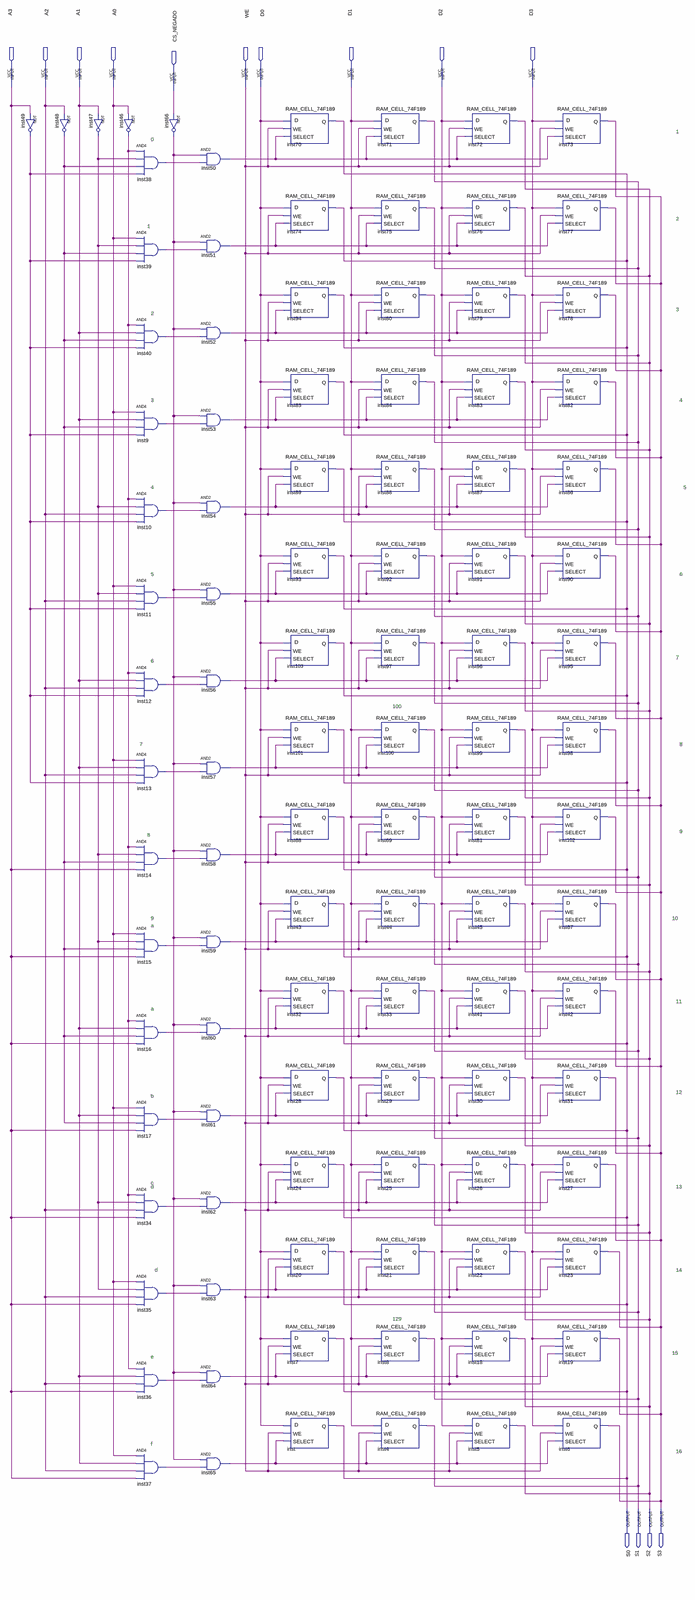
[diagram p0: schematic sheet, whole]
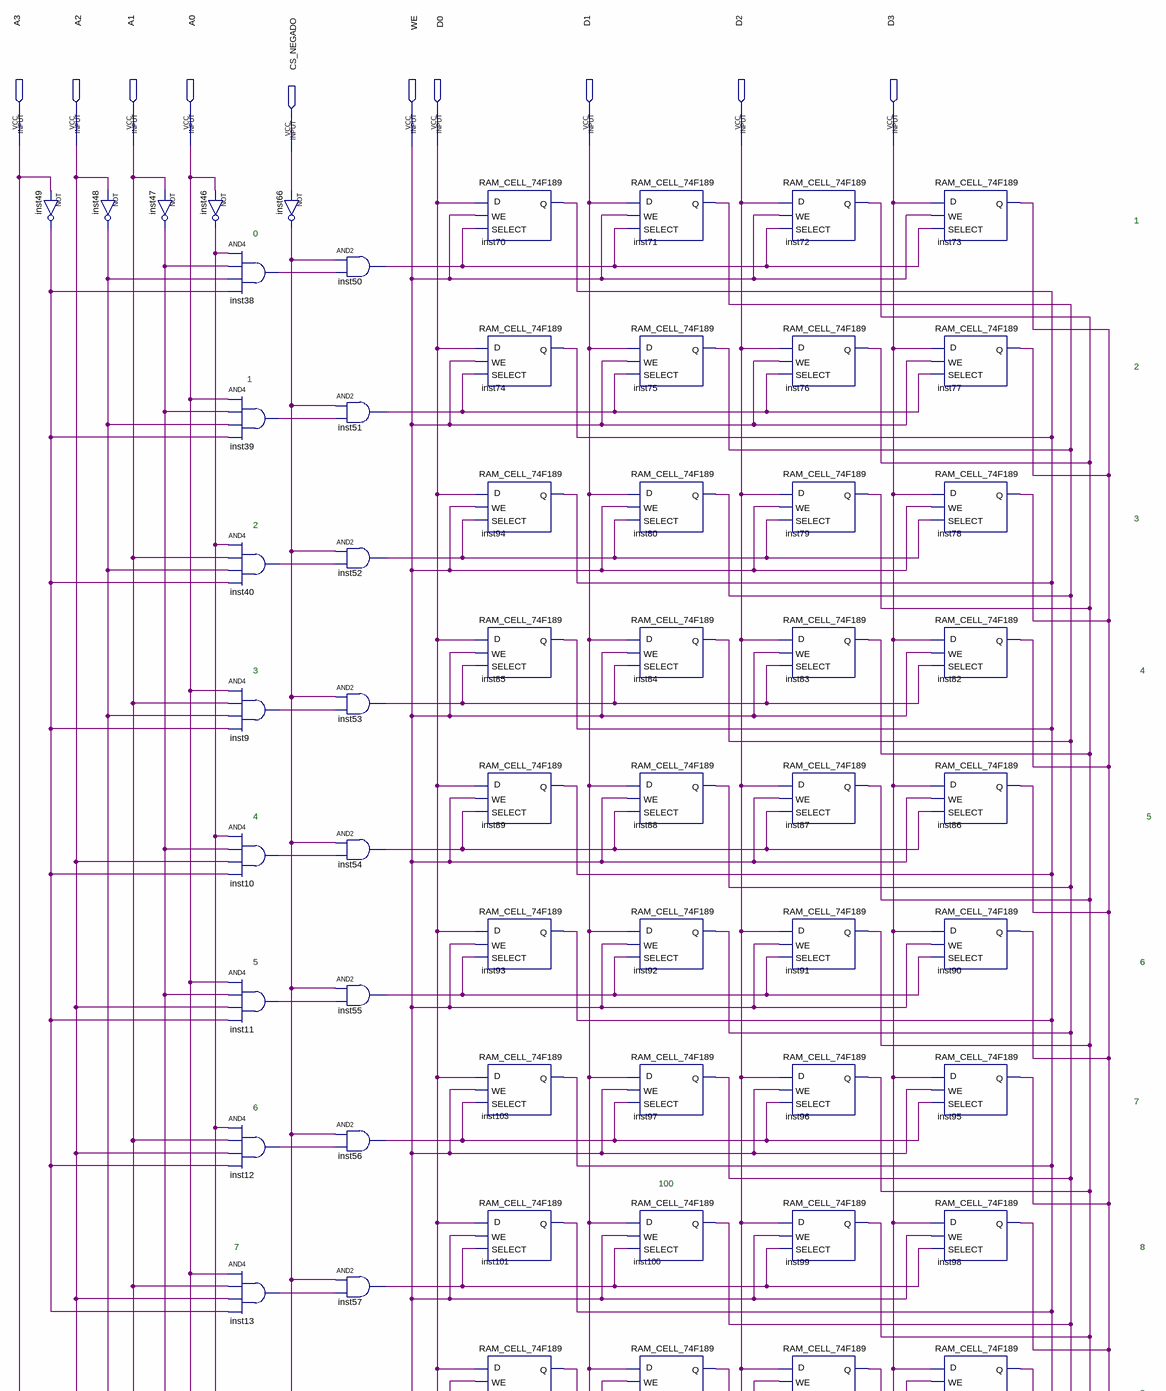
[diagram p1: schematic sheet, upper part]
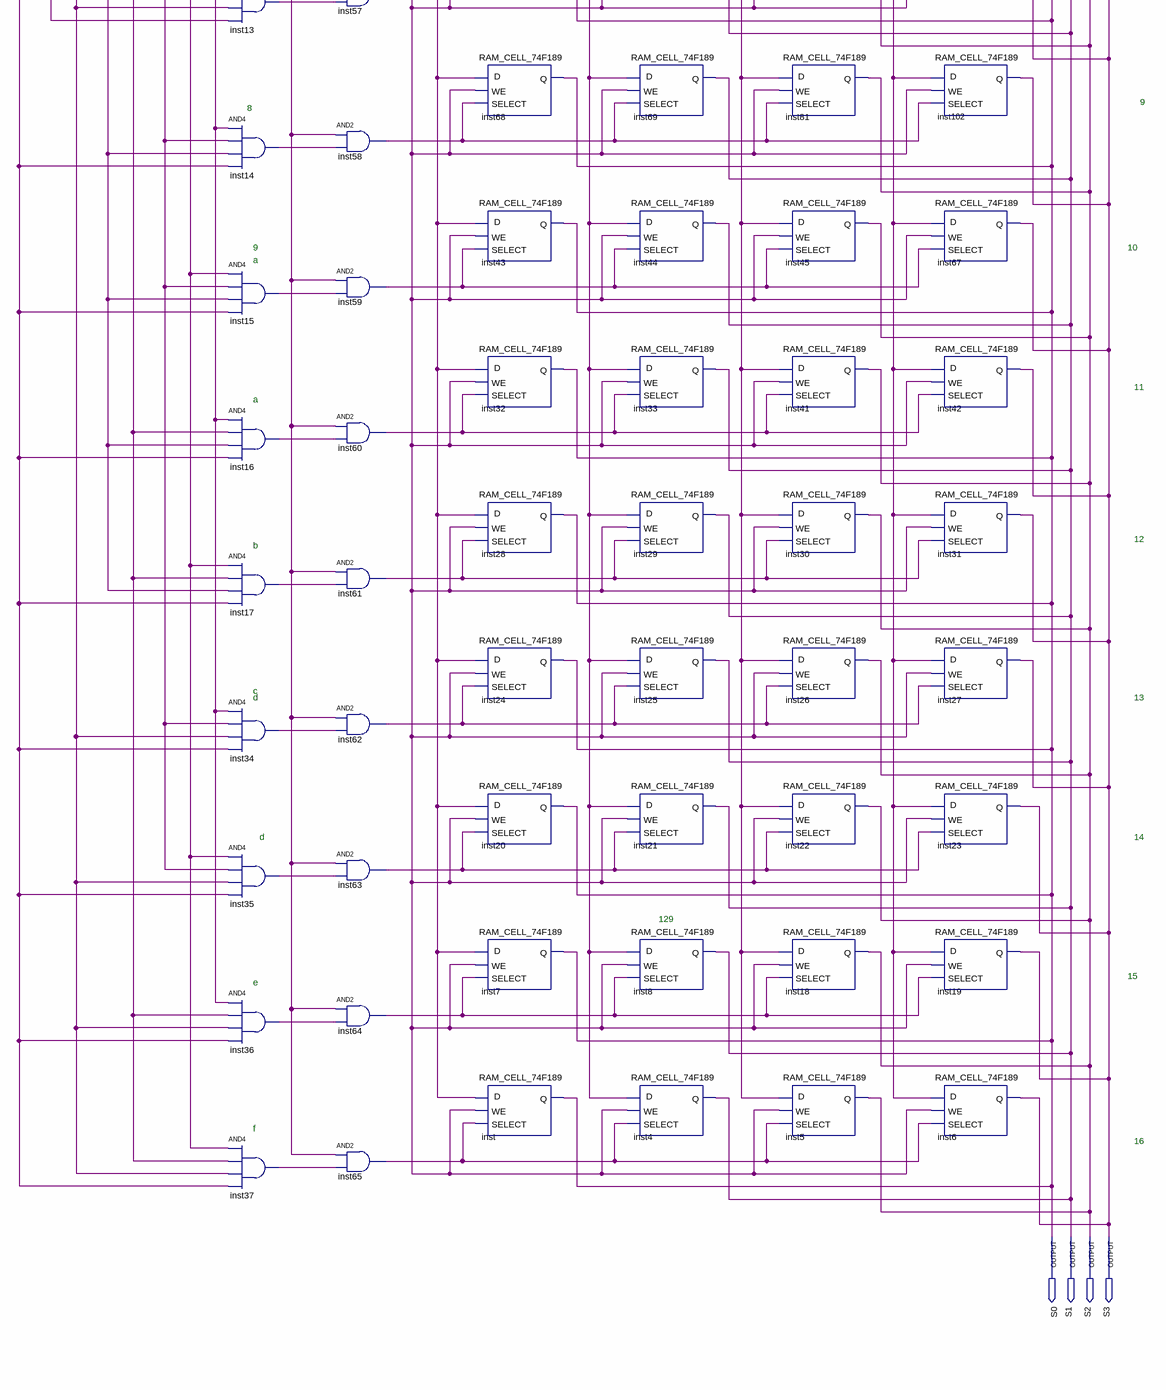
[diagram p2: schematic sheet, lower part]
// Quartus schematic RAM_74F189.bdf as structural Verilog: 101 symbols, 14 pins
module RAM_74F189 (
  input  A3,
  input  A2,
  input  A1,
  input  A0,
  input  WE,
  input  D0,
  input  D1,
  input  D2,
  input  D3,
  input  CS_NEGADO,
  output S0,
  output S1,
  output S2,
  output S3
);

  wire inst9_out, inst10_out, inst11_out, inst12_out, inst13_out, inst14_out, inst15_out, inst16_out,
       inst17_out, inst34_out, inst35_out, inst36_out, inst37_out, inst38_out, inst39_out, inst40_out,
       inst46_out, inst47_out, inst48_out, inst49_out, inst50_out, inst51_out, inst52_out, inst53_out,
       inst54_out, inst55_out, inst56_out, inst57_out, inst58_out, inst59_out, inst60_out, inst61_out,
       inst62_out, inst63_out, inst64_out, inst65_out, inst66_out;

  not inst49 (inst49_out, A3);
  not inst48 (inst48_out, A2);
  not inst47 (inst47_out, A1);
  not inst46 (inst46_out, A0);
  and inst38 (inst38_out, inst46_out, inst47_out, inst48_out, inst49_out);
  and inst39 (inst39_out, A0, inst47_out, inst48_out, inst49_out);
  and inst40 (inst40_out, inst46_out, A1, inst48_out, inst49_out);
  and inst9 (inst9_out, A0, A1, inst48_out, inst49_out);
  and inst10 (inst10_out, inst46_out, inst47_out, A2, inst49_out);
  and inst11 (inst11_out, A0, inst47_out, A2, inst49_out);
  and inst12 (inst12_out, inst46_out, A1, A2, inst49_out);
  and inst13 (inst13_out, A0, A1, A2, inst49_out);
  and inst14 (inst14_out, inst46_out, inst47_out, inst48_out, A3);
  and inst15 (inst15_out, A0, inst47_out, inst48_out, A3);
  and inst16 (inst16_out, inst46_out, A1, inst48_out, A3);
  and inst17 (inst17_out, A0, A1, inst48_out, A3);
  and inst34 (inst34_out, inst46_out, inst47_out, A2, A3);
  and inst35 (inst35_out, A0, inst47_out, A2, A3);
  and inst36 (inst36_out, inst46_out, A1, A2, A3);
  and inst37 (inst37_out, A0, A1, A2, A3);
  not inst66 (inst66_out, CS_NEGADO);
  and inst50 (inst50_out, inst66_out, inst38_out);
  and inst51 (inst51_out, inst66_out, inst39_out);
  and inst52 (inst52_out, inst66_out, inst40_out);
  and inst53 (inst53_out, inst66_out, inst9_out);
  and inst54 (inst54_out, inst66_out, inst10_out);
  and inst55 (inst55_out, inst66_out, inst11_out);
  and inst56 (inst56_out, inst66_out, inst12_out);
  and inst57 (inst57_out, inst66_out, inst13_out);
  and inst58 (inst58_out, inst66_out, inst14_out);
  and inst59 (inst59_out, inst66_out, inst15_out);
  and inst60 (inst60_out, inst66_out, inst16_out);
  and inst61 (inst61_out, inst66_out, inst17_out);
  and inst62 (inst62_out, inst66_out, inst34_out);
  and inst63 (inst63_out, inst66_out, inst35_out);
  and inst64 (inst64_out, inst66_out, inst36_out);
  and inst65 (inst65_out, inst66_out, inst37_out);
  RAM_CELL_74F189 inst70 (.WE(WE), .SELECT(inst50_out), .D(D0), .Q(S0));
  RAM_CELL_74F189 inst74 (.WE(WE), .SELECT(inst51_out), .D(D0), .Q(S0));
  RAM_CELL_74F189 inst94 (.WE(WE), .SELECT(inst52_out), .D(D0), .Q(S0));
  RAM_CELL_74F189 inst85 (.WE(WE), .SELECT(inst53_out), .D(D0), .Q(S0));
  RAM_CELL_74F189 inst89 (.WE(WE), .SELECT(inst54_out), .D(D0), .Q(S0));
  RAM_CELL_74F189 inst93 (.WE(WE), .SELECT(inst55_out), .D(D0), .Q(S0));
  RAM_CELL_74F189 inst103 (.WE(WE), .SELECT(inst56_out), .D(D0), .Q(S0));
  RAM_CELL_74F189 inst101 (.WE(WE), .SELECT(inst57_out), .D(D0), .Q(S0));
  RAM_CELL_74F189 inst68 (.WE(WE), .SELECT(inst58_out), .D(D0), .Q(S0));
  RAM_CELL_74F189 inst43 (.WE(WE), .SELECT(inst59_out), .D(D0), .Q(S0));
  RAM_CELL_74F189 inst32 (.WE(WE), .SELECT(inst60_out), .D(D0), .Q(S0));
  RAM_CELL_74F189 inst28 (.WE(WE), .SELECT(inst61_out), .D(D0), .Q(S0));
  RAM_CELL_74F189 inst24 (.WE(WE), .SELECT(inst62_out), .D(D0), .Q(S0));
  RAM_CELL_74F189 inst20 (.WE(WE), .SELECT(inst63_out), .D(D0), .Q(S0));
  RAM_CELL_74F189 inst7 (.WE(WE), .SELECT(inst64_out), .D(D0), .Q(S0));
  RAM_CELL_74F189 inst (.WE(WE), .SELECT(inst65_out), .D(D0), .Q(S0));
  RAM_CELL_74F189 inst71 (.WE(WE), .SELECT(inst50_out), .D(D1), .Q(S1));
  RAM_CELL_74F189 inst75 (.WE(WE), .SELECT(inst51_out), .D(D1), .Q(S1));
  RAM_CELL_74F189 inst80 (.WE(WE), .SELECT(inst52_out), .D(D1), .Q(S1));
  RAM_CELL_74F189 inst84 (.WE(WE), .SELECT(inst53_out), .D(D1), .Q(S1));
  RAM_CELL_74F189 inst88 (.WE(WE), .SELECT(inst54_out), .D(D1), .Q(S1));
  RAM_CELL_74F189 inst92 (.WE(WE), .SELECT(inst55_out), .D(D1), .Q(S1));
  RAM_CELL_74F189 inst97 (.WE(WE), .SELECT(inst56_out), .D(D1), .Q(S1));
  RAM_CELL_74F189 inst100 (.WE(WE), .SELECT(inst57_out), .D(D1), .Q(S1));
  RAM_CELL_74F189 inst69 (.WE(WE), .SELECT(inst58_out), .D(D1), .Q(S1));
  RAM_CELL_74F189 inst44 (.WE(WE), .SELECT(inst59_out), .D(D1), .Q(S1));
  RAM_CELL_74F189 inst33 (.WE(WE), .SELECT(inst60_out), .D(D1), .Q(S1));
  RAM_CELL_74F189 inst29 (.WE(WE), .SELECT(inst61_out), .D(D1), .Q(S1));
  RAM_CELL_74F189 inst25 (.WE(WE), .SELECT(inst62_out), .D(D1), .Q(S1));
  RAM_CELL_74F189 inst21 (.WE(WE), .SELECT(inst63_out), .D(D1), .Q(S1));
  RAM_CELL_74F189 inst8 (.WE(WE), .SELECT(inst64_out), .D(D1), .Q(S1));
  RAM_CELL_74F189 inst4 (.WE(WE), .SELECT(inst65_out), .D(D1), .Q(S1));
  RAM_CELL_74F189 inst72 (.WE(WE), .SELECT(inst50_out), .D(D2), .Q(S2));
  RAM_CELL_74F189 inst76 (.WE(WE), .SELECT(inst51_out), .D(D2), .Q(S2));
  RAM_CELL_74F189 inst79 (.WE(WE), .SELECT(inst52_out), .D(D2), .Q(S2));
  RAM_CELL_74F189 inst83 (.WE(WE), .SELECT(inst53_out), .D(D2), .Q(S2));
  RAM_CELL_74F189 inst87 (.WE(WE), .SELECT(inst54_out), .D(D2), .Q(S2));
  RAM_CELL_74F189 inst91 (.WE(WE), .SELECT(inst55_out), .D(D2), .Q(S2));
  RAM_CELL_74F189 inst96 (.WE(WE), .SELECT(inst56_out), .D(D2), .Q(S2));
  RAM_CELL_74F189 inst99 (.WE(WE), .SELECT(inst57_out), .D(D2), .Q(S2));
  RAM_CELL_74F189 inst81 (.WE(WE), .SELECT(inst58_out), .D(D2), .Q(S2));
  RAM_CELL_74F189 inst45 (.WE(WE), .SELECT(inst59_out), .D(D2), .Q(S2));
  RAM_CELL_74F189 inst41 (.WE(WE), .SELECT(inst60_out), .D(D2), .Q(S2));
  RAM_CELL_74F189 inst30 (.WE(WE), .SELECT(inst61_out), .D(D2), .Q(S2));
  RAM_CELL_74F189 inst26 (.WE(WE), .SELECT(inst62_out), .D(D2), .Q(S2));
  RAM_CELL_74F189 inst22 (.WE(WE), .SELECT(inst63_out), .D(D2), .Q(S2));
  RAM_CELL_74F189 inst18 (.WE(WE), .SELECT(inst64_out), .D(D2), .Q(S2));
  RAM_CELL_74F189 inst5 (.WE(WE), .SELECT(inst65_out), .D(D2), .Q(S2));
  RAM_CELL_74F189 inst73 (.WE(WE), .SELECT(inst50_out), .D(D3), .Q(S3));
  RAM_CELL_74F189 inst77 (.WE(WE), .SELECT(inst51_out), .D(D3), .Q(S3));
  RAM_CELL_74F189 inst78 (.WE(WE), .SELECT(inst52_out), .D(D3), .Q(S3));
  RAM_CELL_74F189 inst82 (.WE(WE), .SELECT(inst53_out), .D(D3), .Q(S3));
  RAM_CELL_74F189 inst86 (.WE(WE), .SELECT(inst54_out), .D(D3), .Q(S3));
  RAM_CELL_74F189 inst90 (.WE(WE), .SELECT(inst55_out), .D(D3), .Q(S3));
  RAM_CELL_74F189 inst95 (.WE(WE), .SELECT(inst56_out), .D(D3), .Q(S3));
  RAM_CELL_74F189 inst98 (.WE(WE), .SELECT(inst57_out), .D(D3), .Q(S3));
  RAM_CELL_74F189 inst102 (.WE(WE), .SELECT(inst58_out), .D(D3), .Q(S3));
  RAM_CELL_74F189 inst67 (.WE(WE), .SELECT(inst59_out), .D(D3), .Q(S3));
  RAM_CELL_74F189 inst42 (.WE(WE), .SELECT(inst60_out), .D(D3), .Q(S3));
  RAM_CELL_74F189 inst31 (.WE(WE), .SELECT(inst61_out), .D(D3), .Q(S3));
  RAM_CELL_74F189 inst27 (.WE(WE), .SELECT(inst62_out), .D(D3), .Q(S3));
  RAM_CELL_74F189 inst23 (.WE(WE), .SELECT(inst63_out), .D(D3), .Q(S3));
  RAM_CELL_74F189 inst19 (.WE(WE), .SELECT(inst64_out), .D(D3), .Q(S3));
  RAM_CELL_74F189 inst6 (.WE(WE), .SELECT(inst65_out), .D(D3), .Q(S3));

  // Notes on the sheet:
  //   1
  //   0
  //   2
  //   1
  //   3
  //   2
  //   3
  //   4
  //   4
  //   5
  //   5
  //   6
  //   7
  //   6
  //   100
  //   7
  //   8
  //   9
  //   8
  //   9
  //   10
  //   a
  //   11
  //   a
  //   12
  //   b
  //   c
  //   d
  //   13
  //   d
  //   14
  //   129
  //   15
  //   e
  //   f
  //   16
endmodule
